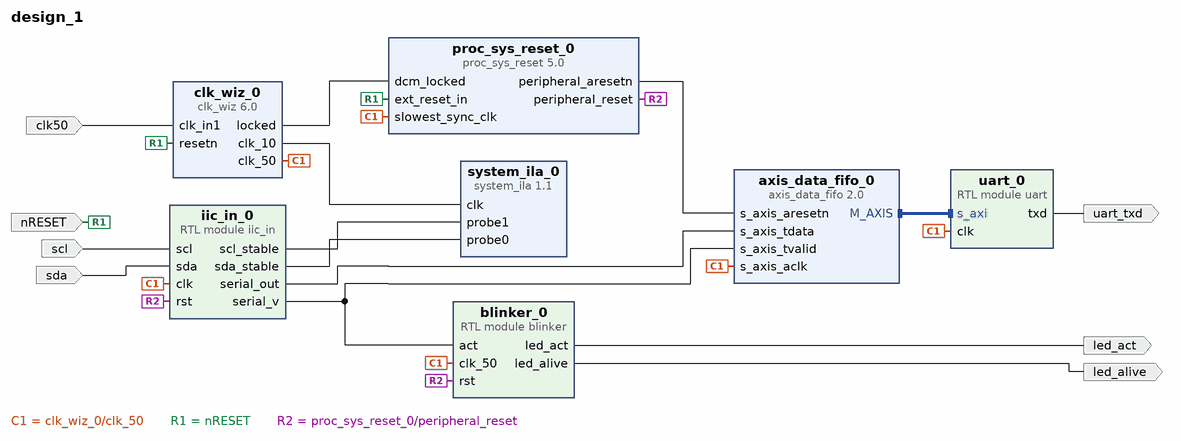
[diagram p0: block diagram of the top level]
# Vivado block design design_1, xc7s15ftgb196-2, Vivado 2021.1
create_bd_design design_1

create_bd_port -dir I -type clk clk50
set_property -dict {CONFIG.FREQ_HZ 50000000} [get_bd_ports clk50]
create_bd_port -dir I sda
create_bd_port -dir I scl
create_bd_port -dir I -type rst nRESET
create_bd_port -dir O uart_txd
create_bd_port -dir O led_alive
create_bd_port -dir O led_act

create_bd_cell -type ip -vlnv xilinx.com:ip:axis_data_fifo:2.0 axis_data_fifo_0
create_bd_cell -type ip -vlnv xilinx.com:ip:proc_sys_reset:5.0 proc_sys_reset_0
create_bd_cell -type ip -vlnv xilinx.com:ip:system_ila:1.1 system_ila_0
set_property -dict [list \
  CONFIG.C_DATA_DEPTH 4096 \
  CONFIG.C_INPUT_PIPE_STAGES 1 \
  CONFIG.C_MON_TYPE NATIVE \
  CONFIG.C_NUM_OF_PROBES 2 \
  CONFIG.C_SLOT_0_AXIS_TDATA_WIDTH 8 \
  CONFIG.C_SLOT_0_INTF_TYPE xilinx.com:interface:axis_rtl:1.0 \
] [get_bd_cells system_ila_0]
create_bd_cell -type module -reference uart uart_0
set_property -dict {CONFIG.CLKFREQ 50000000} [get_bd_cells uart_0]
create_bd_cell -type ip -vlnv xilinx.com:ip:clk_wiz:6.0 clk_wiz_0
set_property -dict [list \
  CONFIG.CLKIN1_JITTER_PS 200.0 \
  CONFIG.CLKOUT1_JITTER 192.113 \
  CONFIG.CLKOUT1_PHASE_ERROR 164.985 \
  CONFIG.CLKOUT1_REQUESTED_OUT_FREQ 50 \
  CONFIG.CLKOUT2_JITTER 285.743 \
  CONFIG.CLKOUT2_PHASE_ERROR 164.985 \
  CONFIG.CLKOUT2_REQUESTED_OUT_FREQ 10 \
  CONFIG.CLKOUT2_USED true \
  CONFIG.CLK_OUT1_PORT clk_50 \
  CONFIG.CLK_OUT2_PORT clk_10 \
  CONFIG.MMCM_CLKFBOUT_MULT_F 20.000 \
  CONFIG.MMCM_CLKIN1_PERIOD 20.000 \
  CONFIG.MMCM_CLKIN2_PERIOD 10.0 \
  CONFIG.MMCM_CLKOUT0_DIVIDE_F 20.000 \
  CONFIG.MMCM_CLKOUT1_DIVIDE 100 \
  CONFIG.NUM_OUT_CLKS 2 \
  CONFIG.PRIM_IN_FREQ 50 \
  CONFIG.RESET_PORT resetn \
  CONFIG.RESET_TYPE ACTIVE_LOW \
] [get_bd_cells clk_wiz_0]
create_bd_cell -type module -reference iic_in iic_in_0
create_bd_cell -type module -reference blinker blinker_0

# ---- connections ----

connect_bd_intf_net [get_bd_intf_pins axis_data_fifo_0/M_AXIS] [get_bd_intf_pins uart_0/s_axi]
connect_bd_net [get_bd_pins blinker_0/led_act] [get_bd_ports led_act]
connect_bd_net [get_bd_pins blinker_0/led_alive] [get_bd_ports led_alive]
connect_bd_net -net clk50_1 [get_bd_pins clk_wiz_0/clk_50] \
  [get_bd_pins axis_data_fifo_0/s_axis_aclk] [get_bd_pins proc_sys_reset_0/slowest_sync_clk] [get_bd_pins uart_0/clk] \
  [get_bd_pins iic_in_0/clk] [get_bd_pins blinker_0/clk_50]
connect_bd_net -net clk50_2 [get_bd_ports clk50] [get_bd_pins clk_wiz_0/clk_in1]
connect_bd_net [get_bd_pins clk_wiz_0/clk_10] [get_bd_pins system_ila_0/clk]
connect_bd_net [get_bd_pins clk_wiz_0/locked] [get_bd_pins proc_sys_reset_0/dcm_locked]
connect_bd_net -net ext_reset_in_0_1 [get_bd_ports nRESET] [get_bd_pins proc_sys_reset_0/ext_reset_in] [get_bd_pins clk_wiz_0/resetn]
connect_bd_net [get_bd_pins iic_in_0/scl_stable] [get_bd_pins system_ila_0/probe1]
connect_bd_net [get_bd_pins iic_in_0/sda_stable] [get_bd_pins system_ila_0/probe0]
connect_bd_net [get_bd_pins iic_in_0/serial_out] [get_bd_pins axis_data_fifo_0/s_axis_tdata]
connect_bd_net [get_bd_pins iic_in_0/serial_v] [get_bd_pins axis_data_fifo_0/s_axis_tvalid] [get_bd_pins blinker_0/act]
connect_bd_net [get_bd_pins proc_sys_reset_0/peripheral_aresetn] [get_bd_pins axis_data_fifo_0/s_axis_aresetn]
connect_bd_net [get_bd_pins proc_sys_reset_0/peripheral_reset] [get_bd_pins iic_in_0/rst] [get_bd_pins blinker_0/rst]
connect_bd_net -net scl_0_1 [get_bd_ports scl] [get_bd_pins iic_in_0/scl]
connect_bd_net -net sda_0_1 [get_bd_ports sda] [get_bd_pins iic_in_0/sda]
connect_bd_net [get_bd_pins uart_0/txd] [get_bd_ports uart_txd]

validate_bd_design
save_bd_design
